# Altium schematic sheet voltage reg. SCH.schdoc
size 49 x 37 mm
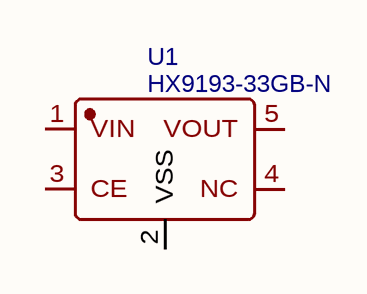
[diagram p0: voltage reg. SCH.schdoc]

## Parts
U1  HX9193-33GB-N  [SOT-23-5_L2.9-W1.6-P0.95-LS2.8-BL]

## Nets

Not connected (* = marked no-connect by the designer): U1 1(VIN) 2(VSS) 3(CE) 4(NC) 5(VOUT)

## Library data of the parts
U1 = HX9193-33GB-N: Manufacturer: HX(恒佳兴); Contributor: lcsc; Supplier: LCSC; Supplier Part: C2995655; Manufacturer Part: HX9193-33GB-N; JLCPCB Part Class: Extended Part; spicePre: U; spiceSymbolName: HX9193-33GB-N